# Altium schematic sheet Indicators.SchDoc
size A4
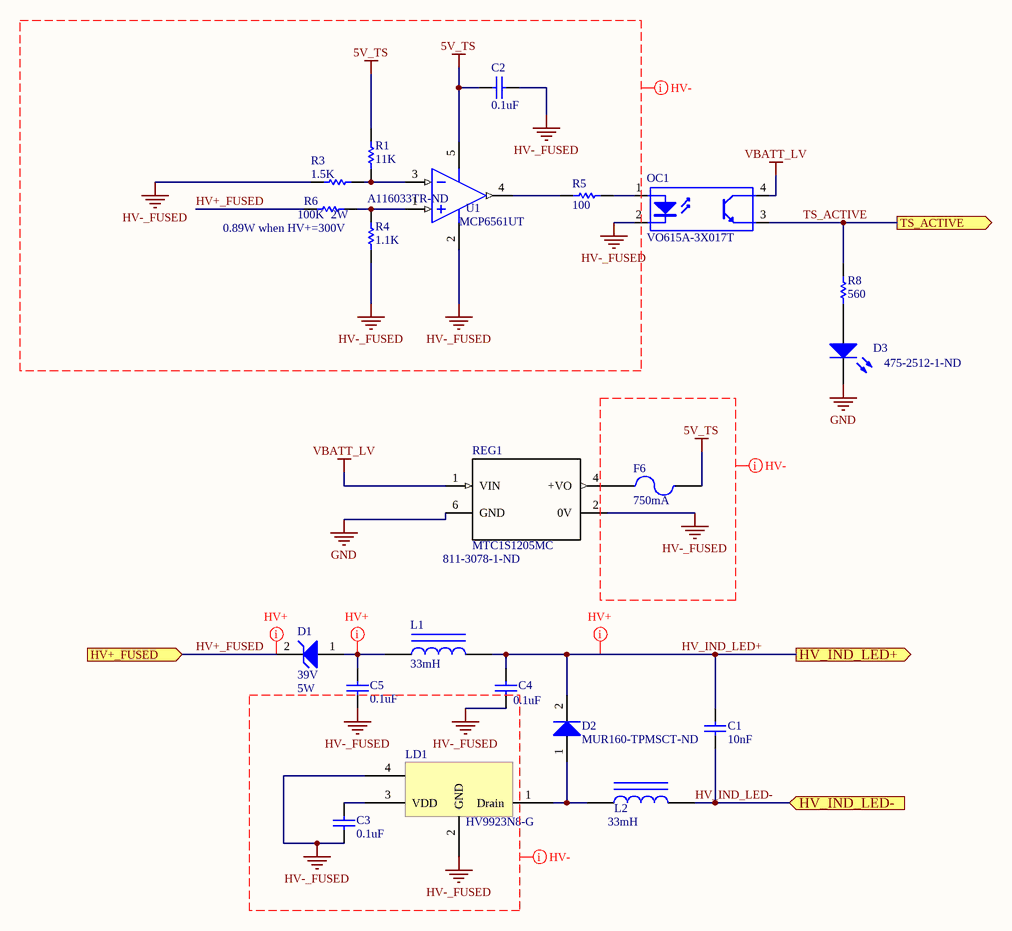
[diagram p0: Indicators.SchDoc]

## Parts
C1  10nF  [0805R-GENERIC]
C2  0.1uF  [1206R-GENERIC]
C3  0.1uF  [1206R-GENERIC]
C4  0.1uF  [1206R-GENERIC]
C5  0.1uF  [1206R-GENERIC]
D1  Voltage: 39V  Power: 5W  [DO-214AA]  (hidden comment: SMBJ5366B-TP)
D2  MUR160-TPMSCT-ND  [DO-41]
D3  SupplierPartNo: 475-2512-1-ND  [J1-0603]
F6  750mA  [FUSEHOLDER 5X20]
L1  33mH  [Radial - 3mm]
L2  33mH  [Radial - 3mm]
LD1  HV9923N8-G  [TO-243AA]
OC1  VO615A-3X017T  [Optocoupler]
R1  11K  [1206R-GENERIC]
R3  1.5K  [1206R-GENERIC]
R4  Supplier Part Number 2: A116033TR-ND  [1206R-GENERIC]  (hidden comment: 1.1K)
R5  100  [1206R-GENERIC]
R6  Power: 2W  [RESC2512(6432)_N]  (hidden comment: 100K)
R8  560  [J1-0603]
REG1  MTC1S1205MC  SupplierPartNo: 811-3078-1-ND  [MTC1S1205MC]
U1  MCP6561UT  [SOT-23-OT5_N]

## Ports
HV+_FUSED (in), HV_IND_LED+ (out), HV_IND_LED- (in), TS_ACTIVE (out)

## Nets
5V_TS: C2.2 F6.1 R1.1 U1.5(VDD)
GND: D3.2(K) REG1.6(GND)
HV-_FUSED: C2.1 C3.1 C4.1 C5.2 LD1.2(GND) LD1.4 OC1.2(K) R3.1 R4.2 REG1.2(0V) U1.2(VSS)
VBATT_LV: OC1.4(C) REG1.1(VIN)
HV+_FUSED: D1.2(K) R6.2 ; port HV+_FUSED
HV_IND_LED+: C1.2 C4.2 D2.2(K) L1.2 ; port HV_IND_LED+
HV_IND_LED-: C1.1 L2.2 ; port HV_IND_LED-
TS_ACTIVE: OC1.3(E) R8.2 ; port TS_ACTIVE
NetC3_2: C3.2 LD1.3(VDD)
NetC5_1: C5.1 D1.1(A) L1.1
NetD2_1: D2.1(A) L2.1 LD1.1(Drain)
NetD3_1: D3.1(A) R8.1
NetF6_2: F6.2 REG1.4(+VO)
NetOC1_1: OC1.1(A) R5.2
NetR1_2: R1.2 R3.2 U1.3(VIN-)
NetR4_1: R4.1 R6.1 U1.1(VIN+)
NetR5_1: R5.1 U1.4(OUT)

## Layout directives
mark named HV-: 5V_TS, HV+_FUSED, HV-_FUSED
mark named HV+: HV+_FUSED, HV_IND_LED+, NetC5_1

## Notes on the sheet
- (near R6) 0.89W when HV+=300V

## Library data of the parts
C1 = Cap: 885342207014:  CAP CER 10000PF 500V X7R 0805; Published: 8-Jun-2000; LatestRevisionDate: 17-Jul-2002; LatestRevisionNote: Re-released for DXP Platform.; PackageReference: RAD-0.3; Publisher: Altium Limited; PackageDescription: Radial Cap, Thru-Hole; 2 Leads; 0.3 in Pin Spacing; Value: 10nF; Supplier 1: Digi-Key; Supplier Part Number 1: 732-12169-1-ND
C2-C5 = Cap: CGA5L4X7T2W104M160AA: CAP CER 0.1UF 450V X7T 1206; Published: 8-Jun-2000; LatestRevisionDate: 17-Jul-2002; LatestRevisionNote: Re-released for DXP Platform.; PackageReference: RAD-0.3; Publisher: Altium Limited; PackageDescription: Radial Cap, Thru-Hole; 2 Leads; 0.3 in Pin Spacing; Value: 0.1uF; Supplier 1: Digi-Key; Supplier Part Number 1: 445-12959-1-ND
D1 = D Zener: DIODE ZENER 39V 5W DO214AA; Published: 8-Jun-2000; LatestRevisionDate: 17-Jul-2002; LatestRevisionNote: Re-released for DXP Platform.; PackageReference: DIODE-0.7; Publisher: Altium Limited; PackageDescription: Diode, Thru-Hole; 2 Leads; 0.7 in Pin Spacing; Supplier 1: Digi-Key; Supplier Part Number 1: SMBJ5366B-TPMSCT-ND
D2 = Diode 1N914: DIODE GEN PURP 600V 1A DO41; Published: 8-Jun-2000; LatestRevisionDate: 17-Jul-2002; LatestRevisionNote: Re-released for DXP Platform.; DatasheetVersion: 1997; PackageReference: DO-35; Publisher: Altium Limited; PackageDescription: Diode, Axial; Body 3.8 x 1.9 mm (LxDia. max), Lead Dia. 0.53 mm (max); Code_JEDEC: DO-204-AH; ComponentLink1Description: Manufacturer Link; ComponentLink1URL: http://www.fairchildsemi.com/; ComponentLink2Description: Datasheet; ComponentLink2URL: http://www.fairchildsemi.com/ds/1N%2F1N4448.pdf; Supplier 1: Digi-Key; Supplier Part Number 1: MUR160-TPMSCT-ND
D3 = LED2: Typical RED, GREEN, YELLOW, AMBER GaAs LED; Published: 8-Jun-2000; LatestRevisionDate: 17-Jul-2002; LatestRevisionNote: Re-released for DXP Platform.; PackageVersion: Feb-2002; PackageReference: 3.2X1.6X1.1; Publisher: Altium Limited; PackageDescription: SM LED; 2 Flat Leads
F6 = Fuse 2: 0031.8201: FUSE BLOK CARTRIDGE 500V 10A PCB; Published: 8-Jun-2000; LatestRevisionDate: 17-Jul-2002; LatestRevisionNote: Re-released for DXP Platform.; PackageReference: PIN-W2/E2.8; Publisher: Altium Limited; PackageDescription: Thru-Hole; 2 Leads; Supplier 2: Digi-Key; Supplier Part Number 2: 486-1258-ND
L1 L2 = Inductor Iron: 22R336C: FIXED IND 33MH 36MA 118.8 OHM TH; Published: 24-Mar-1999; LatestRevisionDate: 17-Jul-2002; LatestRevisionNote: Re-released for DXP Platform.; PackageReference: AXIAL-0.9; Publisher: Altium Limited; PackageDescription: Axial Device, Thru-Hole; 2 Leads; 0.9 in Pin Spacing; Value: 33mH; Supplier 1: Digi-Key; Supplier Part Number 1: 811-1294-ND
LD1 = 1-776163-5: IC LED Driver AC DC Offline Switcher Triac Dimming 30mA Lighting SOT-89-3; Supplier 1: Digi-Key; Supplier Part Number 1: HV9923N8-GCT-ND; ComponentLink1Description: Datasheet; ComponentLink1URL: http://ww1.microchip.com/downloads/en/DeviceDoc/20005311A.pdf
OC1 = Optoisolator1: OPTOISOLATR 5KV TRANSISTOR 4-SMD; Published: 24-Mar-1999; LatestRevisionDate: 04-Mar-2005; LatestRevisionNote: Sch pins 3 & 4 Swapped.; DatasheetVersion: Nov-2003; PackageReference: DIP-4; Publisher: Altium Limited; Supplier 1: Digi-Key; Supplier Part Number 1: VO615A-3X017TCT-ND; ComponentLink1Description: Datasheet; ComponentLink1URL: http://www.vishay.com/docs/81753/vo615a.pdf
R1 = Res1: KTR18EZPF1102: RES SMD 11K OHM 1% 1/4W 1206; Published: 8-Jun-2000; LatestRevisionDate: 17-Jul-2002; LatestRevisionNote: Re-released for DXP Platform.; PackageReference: AXIAL-0.3; Publisher: Altium Limited; PackageDescription: Axial Device, Thru-Hole; 2 Leads; 0.3 in Pin Spacing; Value: 11K; Supplier 1: Digi-Key; Supplier Part Number 1: RHM11KAICT-ND
R3 = Res1: KTR18EZPF1501: RES SMD 1.5K OHM 1% 1/4W 1206; Published: 8-Jun-2000; LatestRevisionDate: 17-Jul-2002; LatestRevisionNote: Re-released for DXP Platform.; PackageReference: AXIAL-0.3; Publisher: Altium Limited; PackageDescription: Axial Device, Thru-Hole; 2 Leads; 0.3 in Pin Spacing; Value: 1.5K; Supplier 1: Digi-Key; Supplier Part Number 1: RHM1.50KAICT-ND
R4 = Res1: RT1210BRD071K1L: RES SMD 1.1K OHM 0.1% 1/4W 1210; Published: 8-Jun-2000; LatestRevisionDate: 17-Jul-2002; LatestRevisionNote: Re-released for DXP Platform.; PackageReference: AXIAL-0.3; Publisher: Altium Limited; PackageDescription: Axial Device, Thru-Hole; 2 Leads; 0.3 in Pin Spacing; Value: 1.1K; Supplier 1: Digi-Key; Supplier Part Number 1: YAG2209CT-ND; Supplier 2: Digi-Key
R5 R8 = Res1: KTR18EZPJ101: RES SMD 100 OHM 5% 1/4W 1206; Published: 8-Jun-2000; LatestRevisionDate: 17-Jul-2002; LatestRevisionNote: Re-released for DXP Platform.; PackageReference: AXIAL-0.3; Publisher: Altium Limited; PackageDescription: Axial Device, Thru-Hole; 2 Leads; 0.3 in Pin Spacing; Supplier 1: Digi-Key; Supplier Part Number 1: RHM100PCT-ND
  R5: Value: 100
  R8: Value: 560
R6 = CMP-1018-00122-1: HVCB2512FKC100K: RES SMD 100K OHM 1% 2W 2512; Case-Metric: 6432; Tolerance: 5 %; Case-EIA: 2512; Value: 100K; Technology: SMT; Supplier 1: Digi-Key; Supplier Part Number 1: HVCB2512FKC100KCT-ND
U1 = CMP-0187-00428-2: 1.8V Low Power Push-Pull Output Comparator, 5-Pin SOT-23, Extended Temperature Range, Tape and Reel; RevisionNote: URLs added.; ComponentLink1URL: http://www.microchip.com/; DatasheetVersion: revB, Aug-2009; ComponentLink3Description: Package Specification; ComponentLink2Description: Datasheet; PackageDescription: 5-Lead Plastic Small Outline Transistor (OT) [SOT-23]; PackageVersion: revBB, Aug-2009; PackageReference: SOT-23-OT5; ComponentLink2URL: http://ww1.microchip.com/downloads/en/DeviceDoc/22139b.pdf; Code_IPC: SOT23-5; ComponentLink1Description: Manufacturer URL; ComponentLink3URL: http://www.microchip.com/stellent/groups/techpub_sg/documents/packagingspec/en012702.pdf; Supplier 1: Digi-Key; Supplier Part Number 1: MCP6561UT-E/OTCT-ND; Supplier 2: Digi-Key; Supplier Part Number 2: MCP6561UT-E/OTDKR-ND
REG1 = MTC1S1205MC: Value: *